# EAGLE design nRF (EAGLE 9.0.0)
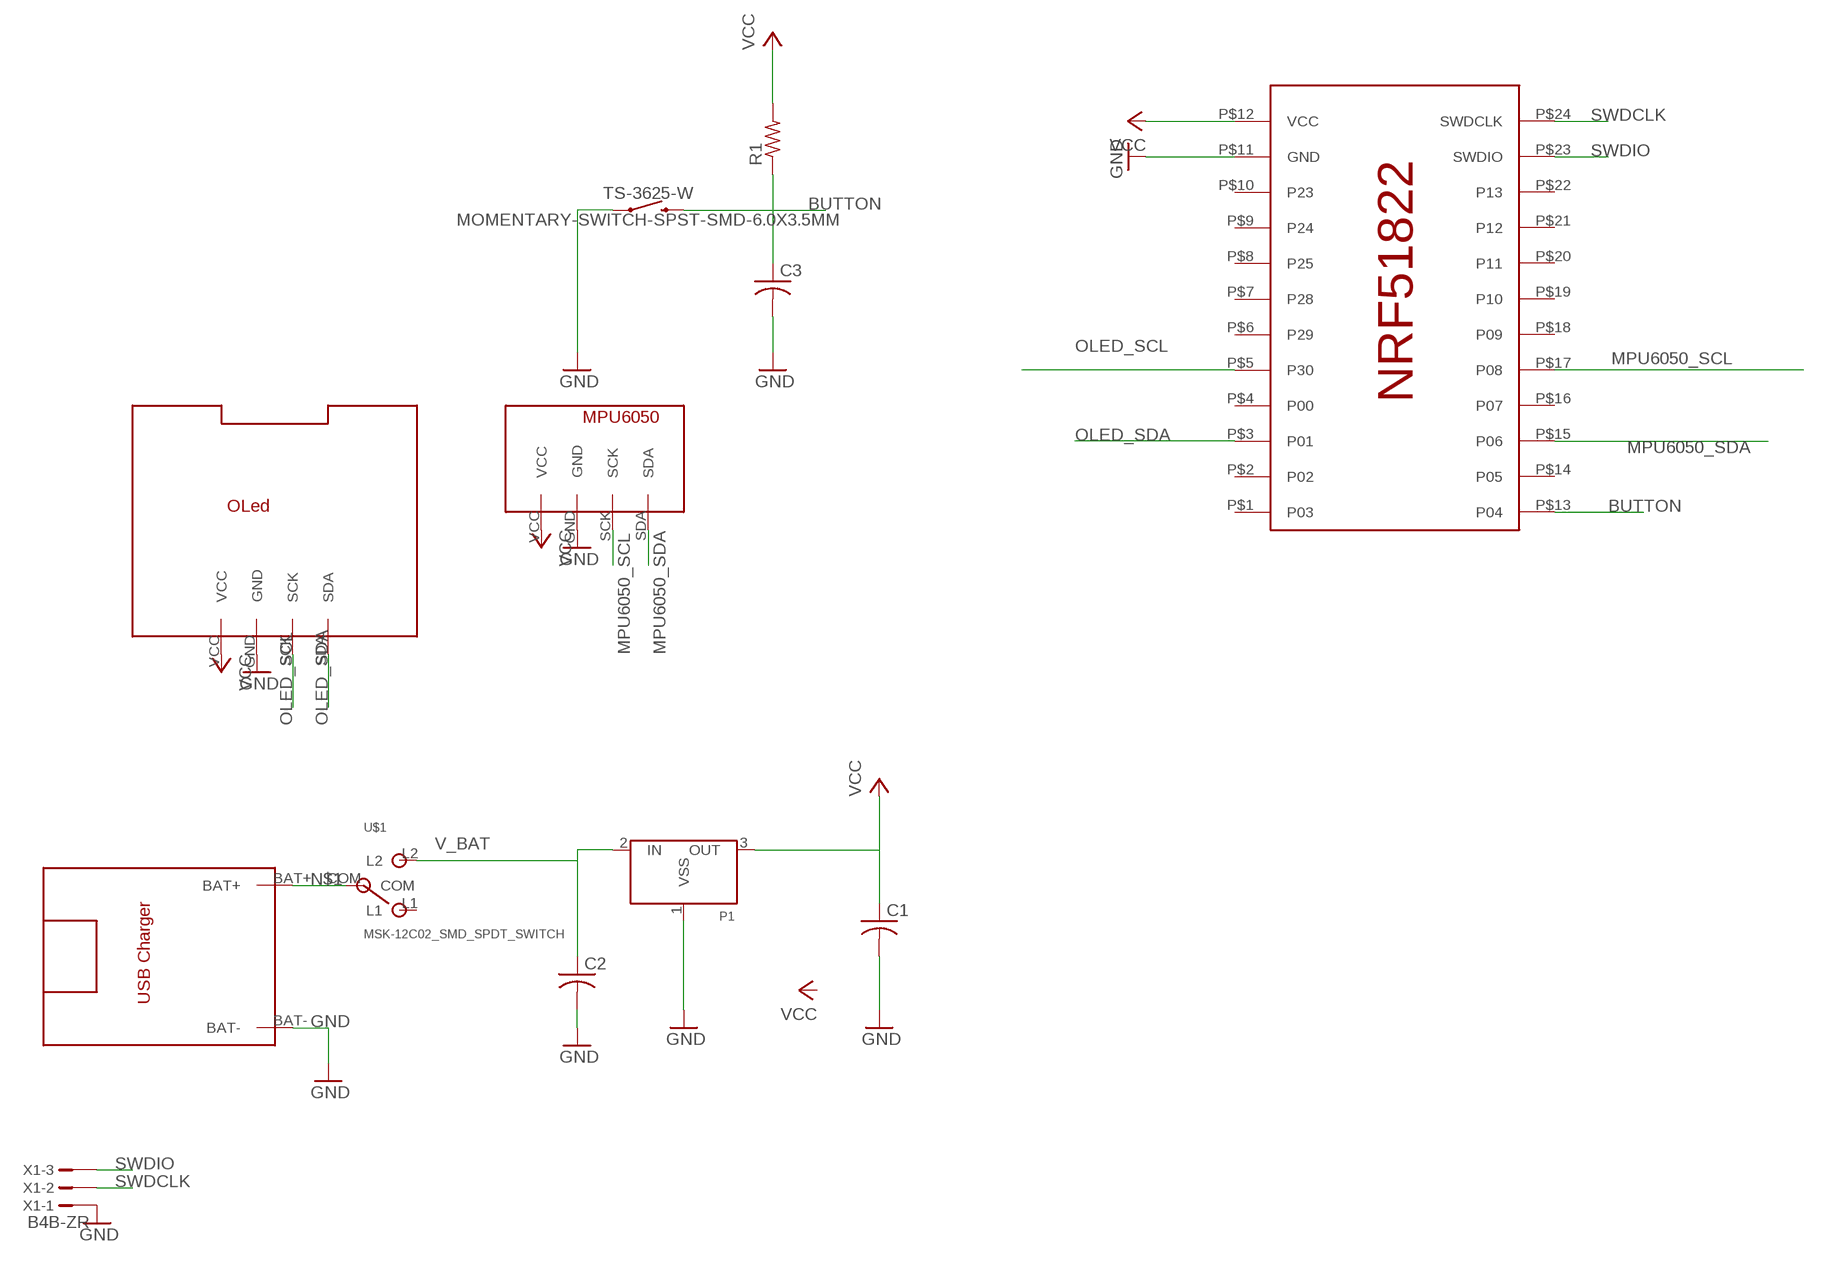
[diagram p0: schematic, sheet 1]

## Parts
C1  C-USC0805  [C0805]
C2  C-USC0805  [C0805]
C3  C-USC0603  [C0603]
P1  XC6206SOT-89  [SOT-89]
R1  R-US_R0603  [R0603]
TS-3625-W  MOMENTARY-SWITCH-SPST-SMD-6.0X3.5MM  [TACTILE_SWITCH_SMD_6.0X3.5MM]
U$1  MSK-12C02_SMD_SPDT_SWITCH  [MSK-12C02]
U$3  OLED  [OLED_1.3_I2C]
U$4  MPU60XX  [MPU6050]
U$5  NRF51822  [NRF51822_HSHOP]
U$6  TP4056  [TP4056]
X1  B4B-ZR  [B4B-ZR]

## Nets
BUTTON: C3.1 R1.1 TS-3625-W.2 U$5.P$13(P04)
GND: C1.2 C2.2 C3.2 P1.1(VSS) TS-3625-W.1 U$3.GND U$4.GND U$5.P$11(GND) U$6.BAT- X1.1
MPU6050_SCL: U$4.SCK U$5.P$17(P08)
MPU6050_SDA: U$4.SDA U$5.P$15(P06)
N$1: U$1.COM U$6.BAT+
OLED_SCL: U$3.SCK U$5.P$5(P30)
OLED_SDA: U$3.SDA U$5.P$3(P01)
SWDCLK: U$5.P$24(SWDCLK) X1.2
SWDIO: U$5.P$23(SWDIO) X1.3
V_BAT: C2.1 P1.2(IN) U$1.L2
VCC: C1.1 P1.3(OUT) R1.2 U$3.VCC U$4.VCC U$5.P$12(VCC)
Unconnected: U$1.L1 U$5.P$1(P03) U$5.P$2(P02) U$5.P$4(P00) U$5.P$6(P29) U$5.P$7(P28) U$5.P$8(P25) U$5.P$9(P24) U$5.P$10(P23) U$5.P$14(P05) U$5.P$16(P07) U$5.P$18(P09) U$5.P$19(P10) U$5.P$20(P11) U$5.P$21(P12) U$5.P$22(P13) X1.4

## Library data of the parts
C1-C3 = rcl:C-US: CAPACITOR, American symbol; SPICEPREFIX: C
P1 = Voltage Regulator:XC6206: XC6206P , linear regulator. Producted by TOREX.Co Store Information: EXCEL device corporation http://www.excel-d.com/access/index.html
R1 = rcl:R-US_: RESISTOR, American symbol; SPICEPREFIX: R
TS-3625-W = SparkFun-Switches:MOMENTARY-SWITCH-SPST: Momentary Switch (Pushbutton) - SPST Normally-open (NO) SPST momentary switches (buttons, pushbuttons). Variants PTH-12MM - 12mm square, through-hole Momentary Pushbutton Switch - 12mm Square <https://www.sparkfun.com/products/9190> (COM-09190) PTH-6.0MM, PTH-6.0MM-KIT - 6.0mm square, through-hole Mini Pushbutton Switch <https://www.sparkfun.com/products/97> (COM-00097) KIT package intended for soldering kit's - only one side of pads' copper is exposed. PTH-RIGHT-ANGLE-KIT - Right-angle, through-hole Right Angle Tactile Button <https://www.sparkfun.com/products/10791> - Used on SparkFun BigTime Watch Kit <https://www.sparkfun.com/products/11734> SMD-12MM - 12mm square, surface-mount Tactile Button - SMD (12mm) <https://www.sparkfun.com/products/12993> (COM-12993) Used on SparkFun PicoBoard <https://www.sparkfun.com/products/11888> SMD-4.5MM - 4.5mm Square Trackball Switch Used on SparkFun Blackberry Trackballer Breakout <https://www.sparkfun.com/products/13169> SMD-4.6MMX2.8MM - 4.60mm x 2.80mm, surface mount Used on SparkFun SAMD21 Mini Breakout <https://www.sparkfun.com/products/13664> SMD-5.2MM, SMD-5.2-REDUNDANT - 5.2mm square, surface-mount Mini Pushbutton Switch - SMD <https://www.sparkfun.com/products/8720> (COM-08720) Used on Arduino Pro Mini <https://www.sparkfun.com/products/11114> REDUNDANT package connects both switch circuits together SMD-6.0X3.5MM - 6.0 x 3.5mm, surface mount Momentary Reset Switch SMD <https://www.sparkfun.com/products/8229> (COM-08229) SMD-6.2MM-TALL - 6.2mm square, surface mount Tactile Button - SMD (6mm) <https://www.sparkfun.com/products/12992> Used on SparkFun Digital Sandbox <https://www.sparkfun.com/products/12651> SMD-RIGHT-ANGLE - Right-angle, surface mount Used on SparkFun Block for Intel® Edison - Arduino <https://www.sparkfun.com/products/13036>; PROD_ID: SWCH-00815; SF_SKU: COM-08229
U$1 = MSK-12C02 SMD Micro Slider Switch SPDT 2:MSK-12C02_SMD_SPDT_SWITCH: Footprint of the VIMEX MSK-12C02 SPDT SMD Switch Created by mzst on 17-Jan-2016
U$3 = Oled:OLED
U$4 = 6050:MPU60XX
U$5 = nrf51822:NRF51822
U$6 = TP4056 charging module:TP4056
X1 = con-jst:?4B-ZR: ZH CONNECTOR 1.5 mm, 4 pin 1 row Source: http://www.jst.com .. eZH.pdf; MF: FARNELL; MPN: B4B-ZR(LF)(SN); OC_FARNELL: 1830916; OC_NEWARK: 37K9960

## Board
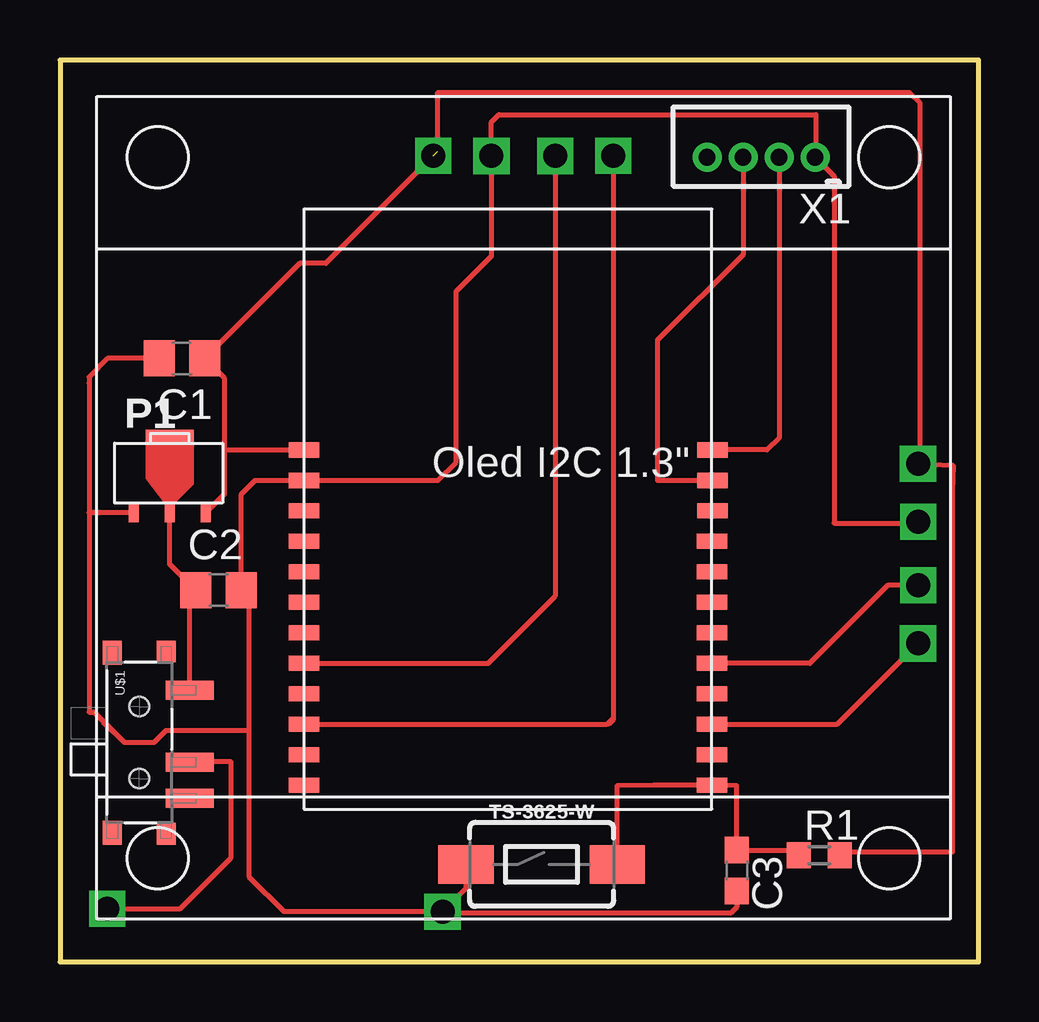
[diagram p1: board, top side]
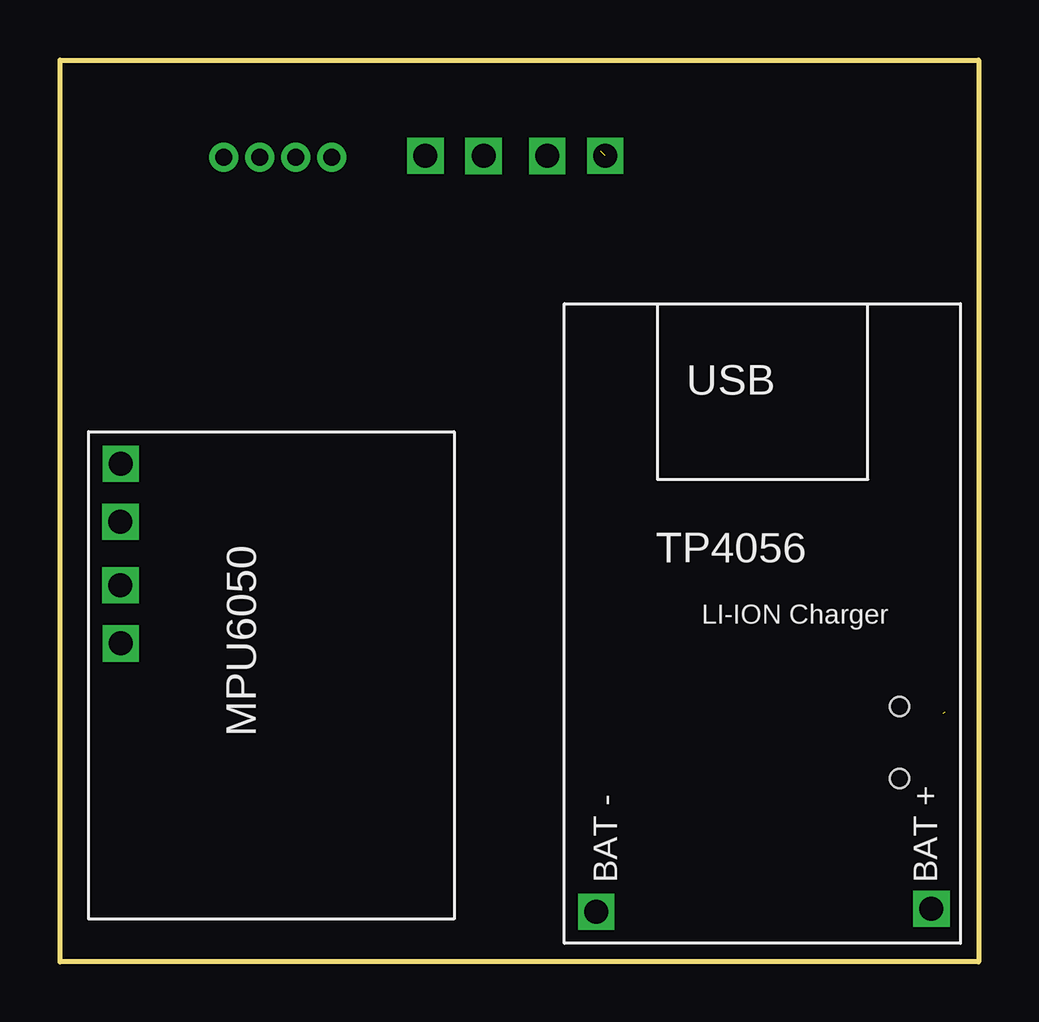
[diagram p2: board, bottom side, seen from below]

Size 38.28 x 37.58 mm. Coordinates in mm from the lower left corner, seen from the top.
Outline: 0,0 38.28,0 38.28,37.58 0,37.58 0,0
Copper layers (1*16): Top 0.035mm / dielectric 1.5mm / Bottom 0.035mm
Design rules "default": minimum track width 10mil, minimum drill 24mil, track to track 8mil, track to pad 8mil, pad to pad 8mil, via to via 8mil, smd to smd 8mil, copper to edge 40mil, drill to drill 8mil, minimum pad ring 10mil, minimum via ring 8mil, stop-mask expansion 4mil, vias tented up to drill 0mil, thermal gap 10mil

### Footprints (pad centres in the part's own frame; a part is rotated, then mirrored left to right if it is on the bottom)
C0805 = smd 1.3 x 1.5: 1 -0.95,0; 2 0.95,0
C0603 = smd 1.1 x 1: 1 -0.85,0; 2 0.85,0
SOT-89 = smd 0.406 x 0.813: 1 -1.5,-1.6; 2 0,-1.6; 3 1.5,-1.6 | smd 2 x 0.5: P$4 0,1.6
R0603 = smd 1 x 1.1: 1 -0.85,0; 2 0.85,0
TACTILE_SWITCH_SMD_6.0X3.5MM = smd 2.3 x 1.6: 1 -3.15,0; 2 3.15,0
MSK-12C02 = smd 0.8 x 2: COM 0.823,2.1; L1 2.323,2.1; L2 -2.177,2.1 | smd 1 x 0.8: GND@1 -3.75,-1.125; GND@4 3.75,-1.125 | smd 0.9 x 0.8: GND@2 -3.8,1.125; GND@3 3.8,1.125 | hole 0.8: -1.5,0; 1.5,0
OLED_1.3_I2C = drill 1 pad 1.422 square: GND 1.214,10.216; SCK 3.866,10.216; SDA 6.287,10.223; VCC -1.206,10.223
MPU6050 = drill 1 pad 1.422 square: GND -6.294,3.866; SCK -6.294,1.214; SDA -6.287,-1.206; VCC -6.287,6.287
NRF51822_HSHOP = smd 1.27 x 0.635: P$1 0,1.27; P$2 0,2.54; P$3 0,3.81; P$4 0,5.08; P$5 0,6.35; P$6 0,7.62; P$7 0,8.89; P$8 0,10.16; P$9 0,11.43; P$10 0,12.7; P$11 0,13.97; P$12 0,15.24; P$13 17,1.27; P$14 17,2.54; P$15 17,3.81; P$16 17,5.08; P$17 17,6.35; P$18 17,7.62; P$19 17,8.89; P$20 17,10.16; P$21 17,11.43; P$22 17.018,12.7; P$23 17.018,13.97; P$24 17.018,15.24
TP4056 = drill 1 pad 1.422 square: BAT+ 8.954,-12.509; BAT- -5.016,-12.636
B4B-ZR = drill 0.7 pad 1.1: 1 -2.25,0; 2 -0.75,0; 3 0.75,0; 4 2.25,0

### Placement (x,y rotation side)
C1  5.08,25.15 180 top
C2  6.6,15.49 0 top
C3  28.19,3.81 270 top
P1  4.57,20.32 0 top
R1  31.64,4.45 0 top
TS-3625-W  20.07,4.06 0 top
U$1  3.3,9.14 270 top
U$3  16.76,23.37 0 top
U$4  29.46,14.48 0 bottom
U$5  10.16,6.1 0 top
U$6  10.92,14.73 0 bottom
X1  29.21,33.53 180 top

### Tracks (layer width: path | path; a pad name or v marks a point on that pad's centre or on a via)
BUTTON
  Top 0.2: TS-3625-W.2 23.2,4.08 23.2,7.34 24.75,7.37 U$5.P$13 28.19,7.35 C3.1 30.57,4.66 R1.1
GND  (1 unrouted)
  Top 0.2: U$4.GND 35.7,18.29 32.26,18.29 32.26,32.73 X1.1 31.5,33.56 31.5,35.31 18.29,35.31 17.98,35 U$3.GND 17.98,29.41 16.51,27.94 16.51,20.83 15.75,20.07 U$5.P$11 | 10.09,20.13 U$5.P$11 | TS-3625-W.1 16.92,3.07 U$6.BAT- | C3.2 28.19,2.29 27.94,2.03 16,2.03 U$6.BAT- | U$6.BAT- 9.33,2.09 7.87,3.56 7.87,9.65 | U$5.P$11 8.13,20.07 7.55,19.49 C2.2 7.87,15.17 7.87,9.65 | 7.87,9.65 4.42,9.65 3.92,9.15 2.68,9.15 1.5,10.34 | 1.22,18.72 1.22,10.41 1.42,10.41 1.79,10.05 1.79,10.02 2.22,9.58 | C1.2 1.98,25.15 1.22,24.38 1.22,24.13 1.22,18.72 | P1.1 1.22,18.72
MPU6050_SCL
  Top 0.2: U$4.SCK 34.49,15.69 31.24,12.45 U$5.P$17
MPU6050_SDA
  Top 0.2: U$5.P$15 32.39,9.91 U$4.SDA
N$1
  Top 0.2: U$6.BAT+ 5.02,2.22 7.11,4.32 7.11,8.36 5.72,8.36 5.72,8.32 U$1.COM
OLED_SCL
  Top 0.2: U$3.SCK 20.63,15.24 17.84,12.45 U$5.P$5
OLED_SDA
  Top 0.2: U$3.SDA 23.05,10.16 | 23.05,10.16 23.05,10.1 22.86,9.91 | U$5.P$3 22.8,9.91 23.05,10.16
SWDCLK
  Top 0.2: X1.2 29.96,21.83 29.46,21.34 U$5.P$24
SWDIO
  Top 0.2: X1.3 28.46,29.48 24.89,25.91 24.89,20.07 U$5.P$23
V_BAT
  Top 0.2: 5.42,11.34 U$1.L2 5.4,15.24 C2.1 4.57,16.58 P1.2
VCC  (1 unrouted)
  Top 0.2: 15.75,33.78 15.75,36.24 35.39,36.24 35.81,35.81 35.81,20.83 U$4.VCC 37.21,20.69 37.19,19.58 37.19,4.57 32.87,4.57 R1.2 | U$3.VCC 11.07,29.11 9.99,29.11 C1.1 | 6.35,25.15 C1.1 | P1.3 6.86,19.51 6.86,21.34 | 6.86,21.34 U$5.P$12 | 6.86,21.34 6.86,24.32 C1.1